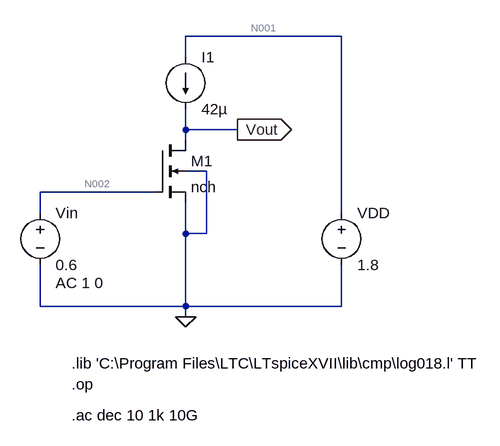
[diagram p0: schematic Ex11.asc]
Ex11.asc, the LTspice schematic file:
Version 4
SHEET 1 880 680
WIRE 464 -16 224 -16
WIRE 224 16 224 -16
WIRE 224 128 224 96
WIRE 304 128 224 128
WIRE 224 144 224 128
WIRE 256 192 224 192
WIRE 176 224 0 224
WIRE 0 256 0 224
WIRE 464 256 464 -16
WIRE 224 288 224 240
WIRE 256 288 256 192
WIRE 256 288 224 288
WIRE 0 400 0 336
WIRE 224 400 224 288
WIRE 224 400 0 400
WIRE 464 400 464 336
WIRE 464 400 224 400
WIRE 224 416 224 400
FLAG 224 416 0
FLAG 304 128 Vout
IOPIN 304 128 Out
SYMBOL nmos4 176 144 R0
SYMATTR InstName M1
SYMATTR Value nch
SYMATTR Value2 l=1u w=10u
SYMBOL voltage 0 240 R0
WINDOW 123 24 124 Left 2
WINDOW 39 0 0 Left 0
SYMATTR Value2 AC 1 0
SYMATTR InstName Vin
SYMATTR Value 0.6
SYMBOL voltage 464 240 R0
WINDOW 123 0 0 Left 0
WINDOW 39 0 0 Left 0
SYMATTR InstName VDD
SYMATTR Value 1.8
SYMBOL current 224 16 R0
WINDOW 123 0 0 Left 0
WINDOW 39 0 0 Left 0
SYMATTR InstName I1
SYMATTR Value 42µ
TEXT 48 488 Left 2 !.lib 'C:\\Program Files\\LTC\\LTspiceXVII\\lib\\cmp\\log018.l' TT
TEXT 48 520 Left 2 !.op
TEXT 48 568 Left 2 !.ac dec 10 1k 10G

The netlist it stands for:
* Ex11.asc
M1 Vout N002 0 0 nch l=1u w=10u
Vin N002 0 0.6 AC 1 0
VDD N001 0 1.8
I1 N001 Vout 42µ
.model NMOS NMOS
.model PMOS PMOS
.lib standard.mos
.lib 'C:\Program Files\LTC\LTspiceXVII\lib\cmp\log018.l' TT
.op
.ac dec 10 1k 10G
.backanno
.end

* Results of the author's LTspice run, read from the files saved beside the schematic
* Operating Point, zero values left out:
*   V(vout) = 416.2 mV
*   V(n002) = 600 mV
*   V(n001) = 1.8 V
*   Id(M1) = 42 µA
*   Is(M1) = -42 µA
*   I(I1) = 42 µA
*   I(Vdd) = -42 µA
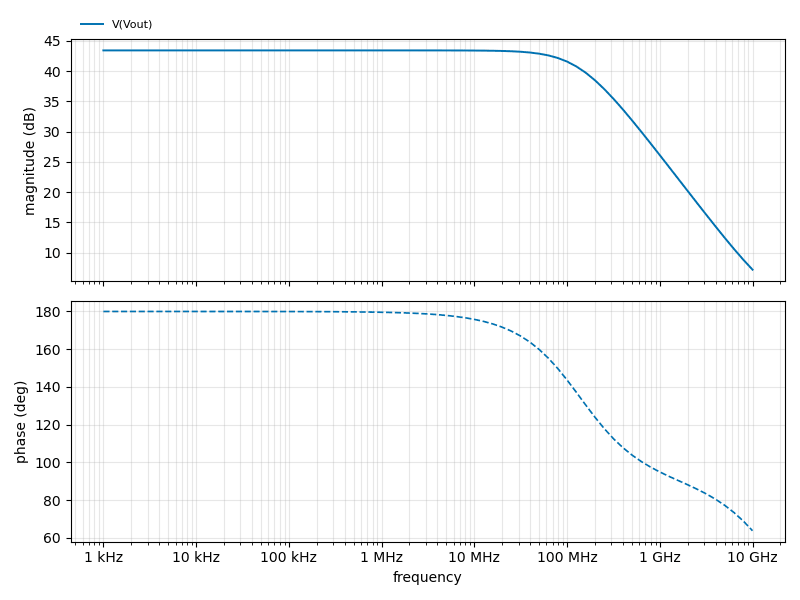
[diagram p1: AC Analysis of Ex11.asc, plotted from the saved traces]
* AC Analysis, 1 run:
*   V(Vout): 43.43 dB at 1 kHz, 7.20 dB at 10 GHz, peak 43.43 dB at 1 kHz, 3 dB below the peak at 136.6 MHz
* From the log:
*   Semiconductor Device Operating Points:
*                           --- BSIM3 MOSFETS ---
*   Name:        m1
*   Model:      nch.5
*   Id:        4.20e-05
*   Vgs:       6.00e-01
*   Vds:       4.16e-01
*   Vbs:       0.00e+00
*   Vth:       4.82e-01
*   Vdsat:     1.62e-01
*   Gm:        4.85e-04
*   Gds:       3.27e-06
*   Gmb        1.39e-04
*   Cbd:       0.00e+00
*   Cbs:       0.00e+00
*   Cgsov:     3.66e-15
*   Cgdov:     3.66e-15
*   Cgbov:     1.81e-16
*   dQgdVgb:   6.25e-14
*   dQgdVdb:  -3.72e-15
*   dQgdVsb:  -5.23e-14
*   dQddVgb:  -3.94e-15
*   dQddVdb:   3.79e-15
*   dQddVsb:   2.43e-16
*   dQbdVgb:  -6.49e-15
*   dQbdVdb:  -1.68e-17
*   dQbdVsb:  -1.38e-14